# EAGLE design ASD2831 (EAGLE 6.3)
DATABASE: ./../../../../../Components/TinyCircuits_Part_Database.txt
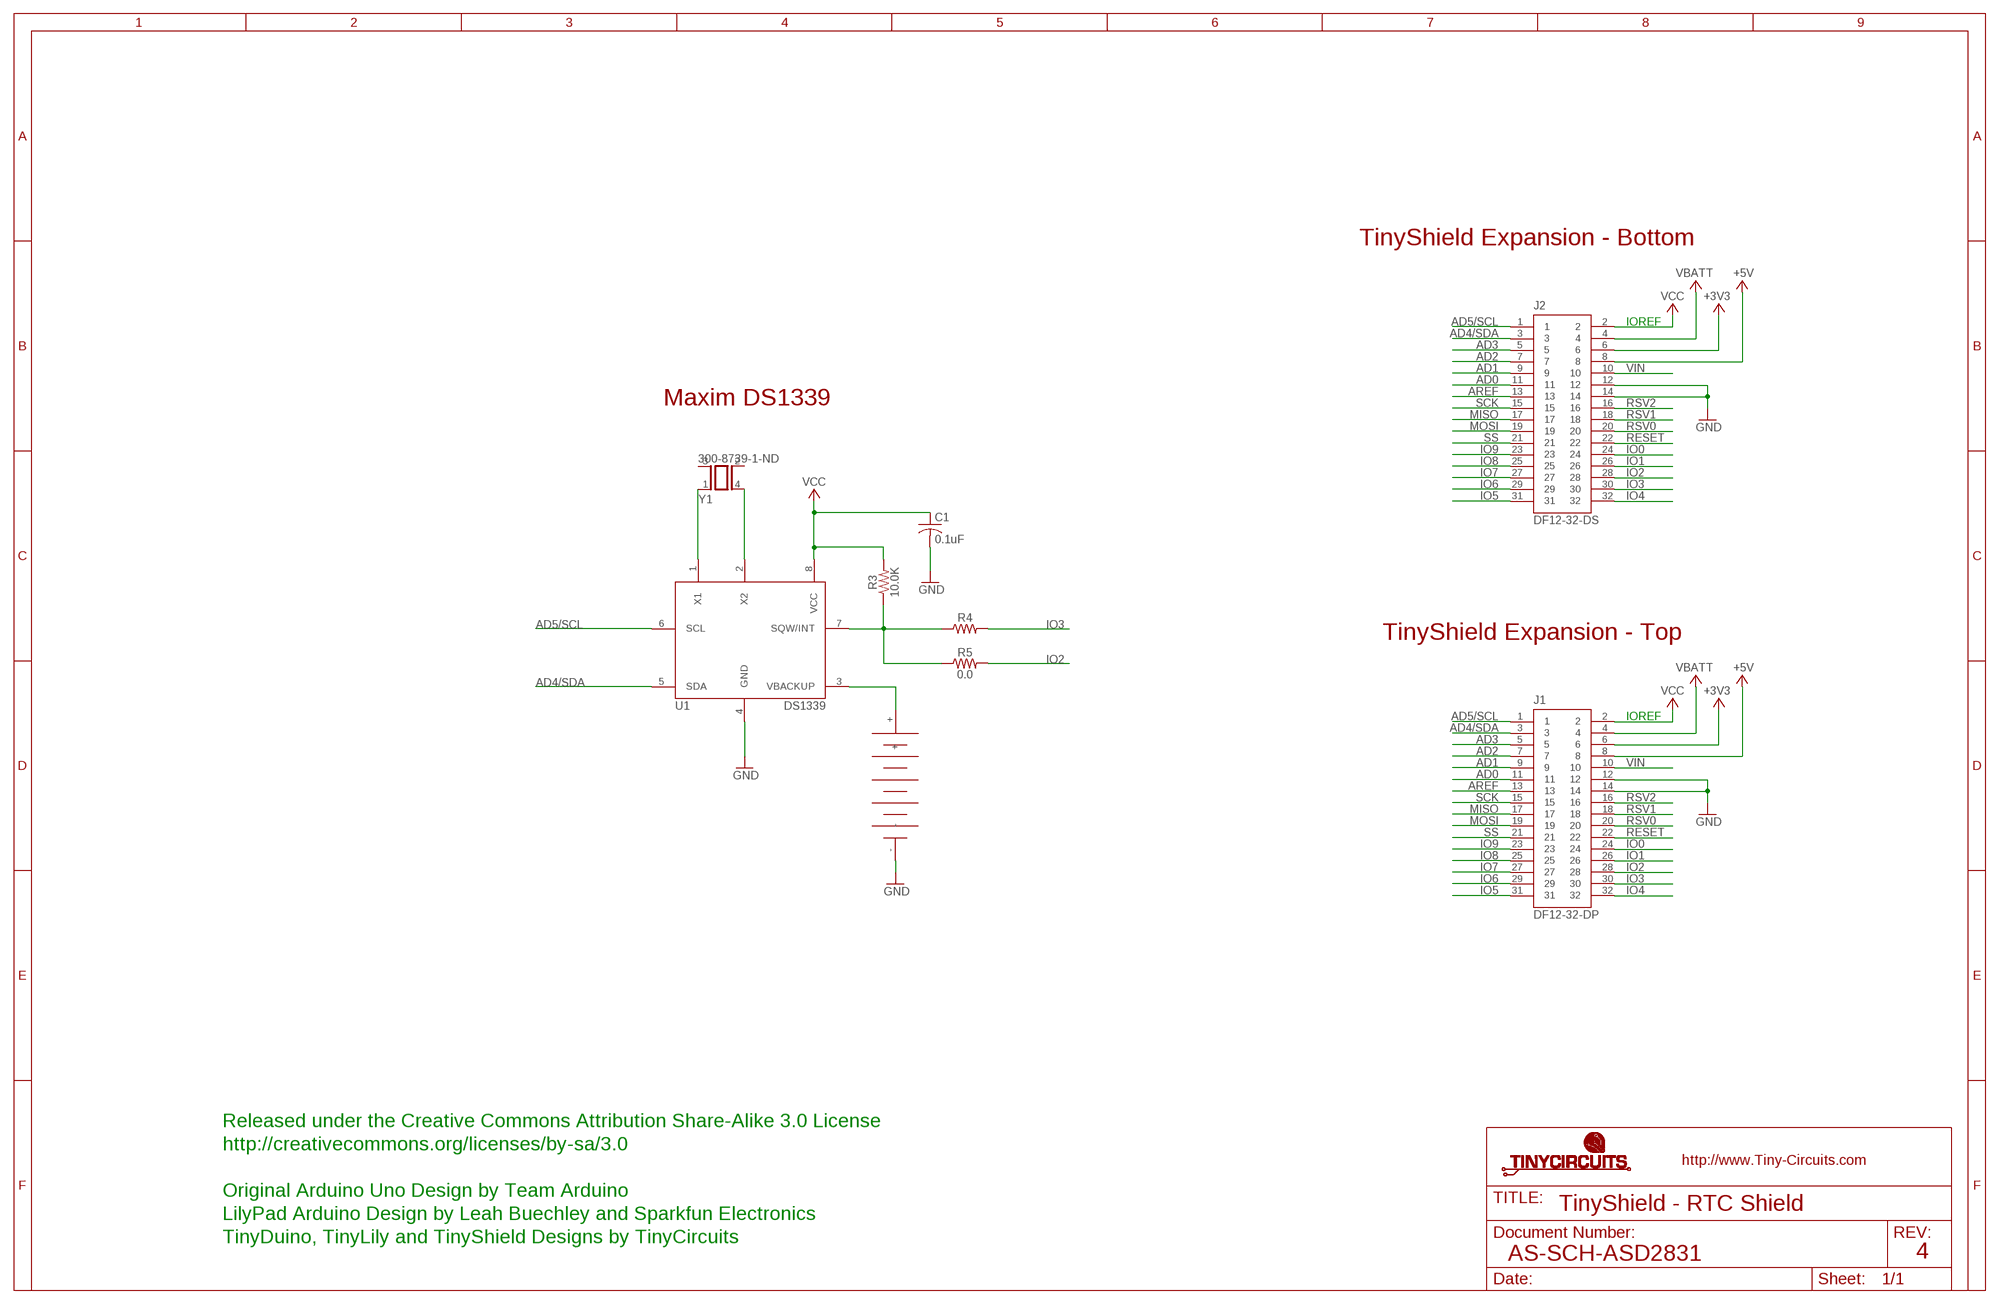
[diagram p0: schematic, sheet 1]

## Parts
B1  ML-920S/DN  AS-ITM-00182  [ML-920S/DN]
C1  0.1uF  AS-ITM-00008  [C0402]
J1  DF12-32-DP  AS-ITM-00015  [DF12-32-DP]
J2  DF12-32-DS  AS-ITM-00012  [DF12-32-DS]
R3  10.0K  AS-ITM-00032  [0402]
R4  AS-ITM-000760402_SHORT  [0402_SHORT]
R5  0.0  AS-ITM-00076  [0402]
U1  DS1339  AS-ITM-00181  [8-USOP]
Y1  300-8739-1-ND  AS-ITM-00183  [CM200C-32.768KDZBT]

## Nets
+3V3: J1.6 J2.6
+5V: J1.8 J2.8
AD0: J1.11 J2.11
AD1: J1.9 J2.9
AD2: J1.7 J2.7
AD3: J1.5 J2.5
AD4/SDA: J1.3 J2.3 U1.5(SDA)
AD5/SCL: J1.1 J2.1 U1.6(SCL)
AREF: J1.13 J2.13
GND: B1.- C1.2 J1.12 J1.14 J2.12 J2.14 U1.4(GND)
IO0: J1.24 J2.24
IO1: J1.26 J2.26
IO2: J1.28 J2.28 R5.2
IO3: J1.30 J2.30 R4.2
IO4: J1.32 J2.32
IO5: J1.31 J2.31
IO6: J1.29 J2.29
IO7: J1.27 J2.27
IO8: J1.25 J2.25
IO9: J1.23 J2.23
MISO: J1.17 J2.17
MOSI: J1.19 J2.19
N$2: U1.1(X1) Y1.1
N$4: U1.2(X2) Y1.4
N$7: R3.1 R4.1 R5.1 U1.7(SQW/INT)
N$10: B1.+ U1.3(VBACKUP)
RESET: J1.22 J2.22
RSV0: J1.20 J2.20
RSV1: J1.18 J2.18
RSV2: J1.16 J2.16
SCK: J1.15 J2.15
SS: J1.21 J2.21
VBATT: J1.4 J2.4
VCC: C1.1 J1.2 J2.2 R3.2 U1.8(VCC)
VIN: J1.10 J2.10
Unconnected: Y1.2 Y1.3

## Notes on the sheet
- TinyShield Expansion - Bottom
- IOREF
- Maxim DS1339
- TinyShield Expansion - Top
- IOREF
- Released under the Creative Commons Attribution Share-Alike 3.0 License
- http://creativecommons.org/licenses/by-sa/3.0
- Original Arduino Uno Design by Team Arduino
- TinyShield - RTC Shield
- LilyPad Arduino Design by Leah Buechley and Sparkfun Electronics
- TinyDuino, TinyLily and TinyShield Designs by TinyCircuits
- AS-SCH-ASD2831 | 4

## Library data of the parts
B1 = tinycircuits:AS-ITM-00182: BATTERY LITH 3V RECHARGE SMD; PARTNO: AS-ITM-00182
C1 = tinycircuits:AS-ITM-00008: CAP CER 0.1UF 16V 10% X5R 0402; PARTNO: AS-ITM-00008
J1 = tinycircuits:AS-ITM-00015: CONN HEADER 32POS 3MM SMD 0.5MM; PARTNO: AS-ITM-00015
J2 = tinycircuits:AS-ITM-00012: CONN RECEPT 32POS 3MM SMD 0.5MM; PARTNO: AS-ITM-00012
R3 = tinycircuits:AS-ITM-00032: RES 10.0K OHM 1/16W 1% 0402 SMD; PARTNO: AS-ITM-00032
R4 = tinycircuits:AS-ITM-00076: RES 0.0 OHM 1/16W 1% 0402 SMD; VALUE: SHORT
R5 = tinycircuits:AS-ITM-00076: RES 0.0 OHM 1/16W 1% 0402 SMD; PARTNO: AS-ITM-00076
U1 = tinycircuits:AS-ITM-00181: IC RTC CLK/CALENDAR I2C 8-USOP; PARTNO: AS-ITM-00181
Y1 = tinycircuits:AS-ITM-00183: CRYSTAL 32.768KHZ 6PF SMD; PARTNO: AS-ITM-00183; VALUE: CM200C-32.768KDZBT

## Board
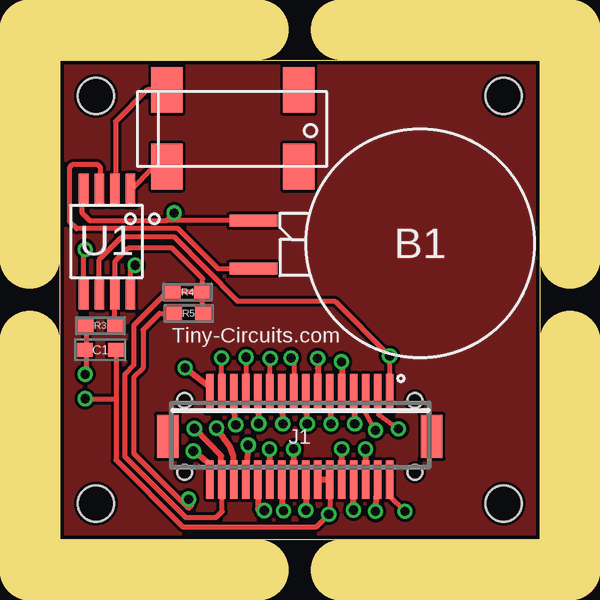
[diagram p1: board, top side]
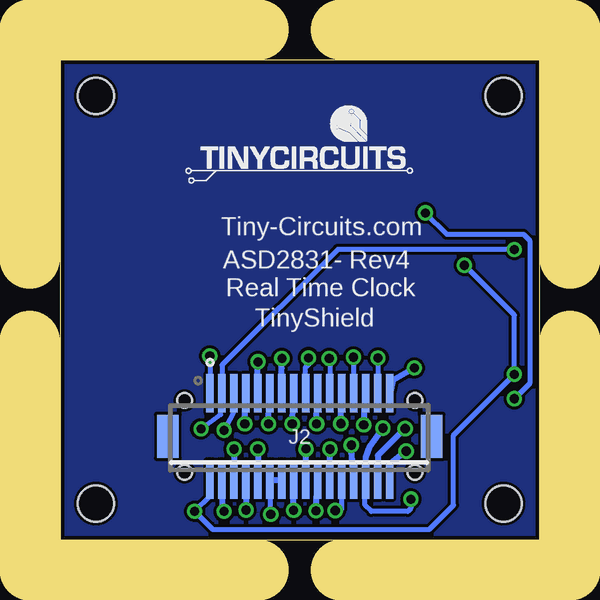
[diagram p2: board, bottom side, seen from below]

Size 20 x 20 mm. Coordinates in mm from the lower left corner, seen from the top.
Outline: 0,20 20,20 20,0 0,0 0,20
Copper layers (1*16): Top 0.035mm / dielectric 1.5mm / Bottom 0.035mm
Design rules "default *": minimum track width 5mil, minimum drill 15mil, track to track 5mil, track to pad 5mil, pad to pad 5mil, via to via 6mil, smd to smd 5mil, copper to edge 6mil, drill to drill 8mil, minimum pad ring 10mil, minimum via ring 5mil, stop-mask expansion 4mil, vias tented up to drill 25mil, thermal gap 10mil
Holes 1.5 mm at 1.5,18.5 18.5,18.5 18.5,1.5 1.5,1.5
tRestrict: 4 lines
Milling: 8 lines

### Footprints (pad centres in the part's own frame; a part is rotated, then mirrored left to right if it is on the bottom)
ML-920S/DN = smd 2 x 0.5: + 6.95,1.05; - 6.95,-0.95
C0402 = smd 0.65 x 0.6: 1 -0.65,0; 2 0.65,0
DF12-32-DP = smd 0.3 x 1.6: 1 -3.75,-1.8; 2 -3.75,1.8; 3 -3.25,-1.8; 4 -3.25,1.8; 5 -2.75,-1.8; 6 -2.75,1.8; 7 -2.25,-1.8; 8 -2.25,1.8; 9 -1.75,-1.8; 10 -1.75,1.8; 11 -1.25,-1.8; 12 -1.25,1.8; 13 -0.75,-1.8; 14 -0.75,1.8; 15 -0.25,-1.8; 16 -0.25,1.8; 17 0.25,-1.8; 18 0.25,1.8; 19 0.75,-1.8; 20 0.75,1.8; 21 1.25,-1.8; 22 1.25,1.8; 23 1.75,-1.8; 24 1.75,1.8; 25 2.25,-1.8; 26 2.25,1.8; 27 2.75,-1.8; 28 2.75,1.8; 29 3.25,-1.8; 30 3.25,1.8; 31 3.75,-1.8; 32 3.75,1.8 | smd 0.9 x 1.8: F1 -5.5,0; F2 5.5,0 | hole 0.6: -4.8,1.5; 4.8,1.5
DF12-32-DS = smd 0.3 x 1.6: 1 -3.75,1.8; 2 -3.75,-1.8; 3 -3.25,1.8; 4 -3.25,-1.8; 5 -2.75,1.8; 6 -2.75,-1.8; 7 -2.25,1.8; 8 -2.25,-1.8; 9 -1.75,1.8; 10 -1.75,-1.8; 11 -1.25,1.8; 12 -1.25,-1.8; 13 -0.75,1.8; 14 -0.75,-1.8; 15 -0.25,1.8; 16 -0.25,-1.8; 17 0.25,1.8; 18 0.25,-1.8; 19 0.75,1.8; 20 0.75,-1.8; 21 1.25,1.8; 22 1.25,-1.8; 23 1.75,1.8; 24 1.75,-1.8; 25 2.25,1.8; 26 2.25,-1.8; 27 2.75,1.8; 28 2.75,-1.8; 29 3.25,1.8; 30 3.25,-1.8; 31 3.75,1.8; 32 3.75,-1.8 | smd 0.9 x 1.8: F1 -5.5,0; F2 5.5,0 | hole 0.6: -4.8,1.5; 4.8,1.5
0402 = smd 0.65 x 0.55: 1 -0.6,0; 2 0.6,0
0402_SHORT = smd 0.65 x 0.55: 1 -0.6,0; 2 0.6,0
8-USOP = smd 0.4 x 1.35: 1 -1,-2.1; 2 -0.35,-2.1; 3 0.3,-2.1; 4 0.95,-2.1; 5 0.95,2.2; 6 0.3,2.2; 7 -0.35,2.2; 8 -1,2.2
CM200C-32.768KDZBT = smd 1.3 x 1.9: 1 -2.69,-1.5; 2 2.81,-1.5; 3 2.81,1.7; 4 -2.69,1.7

### Placement (x,y rotation side)
B1  15.02,12.35 180 top
C1  1.68,7.91 0 top
J1  10,4.3 180 top
J2  10,4.3 0 bottom
R3  1.68,8.92 180 top
R4  5.32,10.32 180 top
R5  5.37,9.43 180 top
U1  1.94,12.48 180 top
U$1  [DOCFIELD-TINYCIRCUITS-PCB]  33.91,-10 0 top  (outside the outline)
Y1  7.14,17.05 0 top

### Tracks (layer width: path | path; a pad name or v marks a point on that pad's centre or on a via)
+3V3  (via drill 0.38)
  Top 0.254: J2.6 v12.75,3.77 v12.74,3.77
  Bottom 0.254: v12.74,3.77 12.74,2.51 J2.6
+5V  (via drill 0.38)
  Top 0.254: v12.24,1.23 J2.8
  Bottom 0.254: J2.8 12.25,1.21 v12.24,1.23
AD0  (via drill 0.38)
  Top 0.254: v11.3,4.83 11.31,5.05 J2.11
  Bottom 0.254: J2.11 11.28,5.79 v11.3,4.83
AD1  (via drill 0.38)
  Top 0.254: J2.9 11.79,6.27 v11.74,7.41
  Bottom 0.254: v11.74,7.41 11.78,6.22 J2.9
AD2  (via drill 0.38)
  Top 0.254: v12.29,4.83 12.31,5.05 J2.7
  Bottom 0.254: J2.7 12.27,5.86 v12.29,4.83
AD3  (via drill 0.38)
  Top 0.203: v13.16,4.56 12.77,5.25 J2.5
  Bottom 0.203: J2.5 12.79,5.23 v13.16,4.56
AD4/SDA  (via drill 0.38)
  Top 0.203: J2.3 13.3,5.2 v14.12,4.62 | 0.99,11.27 U1.5 0.99,12.04 v1.05,12.1
  Bottom 0.203: v14.12,4.62 13.29,5.21 J2.3 13.24,7.27 8.41,12.1 v1.05,12.1
AD5/SCL  (via drill 0.38)
  Top 0.203: J2.1 v13.75,7.65 11.46,9.94 7.4,9.94 4.78,12.61 2.57,12.61 1.64,11.67 U1.6
  Bottom 0.203: v13.75,7.65 J2.1
AREF  (via drill 0.38)
  Top 0.254: J2.13 10.75,7.15 v10.75,7.55
  Bottom 0.254: v10.75,7.55 10.76,7.14 J2.13
GND  (via drill 0.38)
  Top 0.203: B1.- 4.44,13.3 | U1.4 0.92,14.51 0.92,13.62 1.24,13.3 4.44,13.3 | J2.12 11.25,1.09 v11.21,1.05 10.7,0.54 5.11,0.54 2.33,3.32 2.33,5.88 | C1.2 2.33,5.88 | 4.44,13.3 v4.76,13.62 | v1.05,5.88 2.33,5.88
  Top 0.254: J2.12 J2.14
  Bottom 0.203: v11.21,1.05 11.21,2.46 J2.12 | v4.76,13.62 3.87,12.73 0.67,12.73 0.41,12.48 0.41,6.51 v1.05,5.88
  Bottom 0.254: J2.12 J2.14
IO0  (via drill 0.38)
  Top 0.254: J2.24 8.25,1.26 v8.52,1.21
  Bottom 0.203: v8.52,1.21 8.48,1.27 8.25,1.27 J2.24
  Bottom 0.254: J2.24
IO1  (via drill 0.38)
  Top 0.254: v7.85,3.94 J2.26
  Bottom 0.254: 7.85,3.66 J2.26 v7.85,3.94
IO2  (via drill 0.38)
  Top 0.203: v5.37,1.68 5.49,1.56 5.49,1.43 5.37,1.3 3.08,3.59 3.08,6.76 3.46,7.14 3.46,8.75 4.15,9.43 R5.2
  Top 0.254: v6.53,4.64 7.07,3.89 7.22,3.49 7.29,2.61 7.26,2.51 J2.28
  Bottom 0.203: v5.37,1.68 5.37,1.3 5.49,1.18 7.02,1.18 7.27,1.43 7.27,2.48 J2.28
  Bottom 0.254: J2.28 7.24,3.43 7.07,3.88 v6.53,4.64
IO3  (via drill 0.38)
  Top 0.203: J2.30 6.76,2.49 6.76,1.18 6.51,0.92 5.24,0.92 2.7,3.46 2.7,6.89 3.08,7.27 3.08,8.92 4.48,10.32 R4.2
  Top 0.254: J2.30 6.73,3.49 v5.61,4.63
  Bottom 0.254: v5.61,4.63 6.75,3.51 6.77,2.53 J2.30
IO4  (via drill 0.38)
  Top 0.254: J2.32 6.25,3.14 v5.56,3.69
  Bottom 0.254: v5.56,3.69 5.61,3.65 6.21,3.18 6.21,3.14 6.26,3.1 J2.32
IO5  (via drill 0.38)
  Top 0.254: v5.22,7.16 6.23,6.38 J2.31
  Bottom 0.254: J2.31 6.11,6.64 v5.22,7.16
IO6  (via drill 0.38)
  Top 0.203: J2.29 6.75,7.5 6.74,7.5 6.73,7.52 v6.74,7.58
  Top 0.254: J2.29
  Bottom 0.203: v6.74,7.58 6.74,6.11 J2.29
IO7  (via drill 0.38)
  Top 0.254: v7.33,4.78 7.31,4.9 J2.27
  Bottom 0.254: J2.27 7.29,5.76 v7.33,4.78
IO8  (via drill 0.38)
  Top 0.203: v7.76,7.61 7.76,6.11 J2.25
  Bottom 0.203: J2.25 7.75,7.72 v7.76,7.61
IO9  (via drill 0.38)
  Top 0.254: v8.29,4.83 8.31,4.98 J2.23
  Bottom 0.254: J2.23 8.28,5.59 v8.29,4.83
MISO  (via drill 0.38)
  Top 0.203: v9.63,7.58 9.75,7.46 J2.17
  Bottom 0.203: J2.17 9.76,6.11 9.76,7.17 9.63,7.3 v9.63,7.58
MOSI  (via drill 0.38)
  Top 0.254: v9.3,4.83 9.31,4.95 J2.19
  Bottom 0.254: J2.19 9.27,5.76 v9.3,4.83
N$1
  pour Top: 0.06,0.13 19.92,0.09 19.93,0.09 19.97,19.96 0.06,19.96 0.08,0.13
N$2
  Top 0.203: Y1.1 3.91,15.55 U1.1
N$3
  pour Bottom: 0.06,0.12 19.92,0.09 19.97,19.98 0.08,19.98 0.09,0.14
N$4
  Top 0.203: Y1.4 3.64,18.75 2.32,17.43 2.32,14.55 | 2.32,14 2.32,14.55 | 2.32,14.55 U1.2
N$7
  Top 0.203: R3.1 U1.7 2.29,11.58 2.85,12.15 4.68,12.15 5.95,10.88 5.95,9.34 R5.1 R4.1
N$10
  Top 0.203: 7.81,11.3 B1.+ 6.59,11.3 4.94,12.96 0.69,12.96 0.41,13.24 0.41,15.53 0.54,15.65 1.56,15.65 1.68,15.53 1.68,14.62 U1.3
RESET  (via drill 0.38)
  Top 0.254: v8.74,3.77 J2.22
  Bottom 0.254: J2.22 8.75,3.69 v8.74,3.77
RSV0  (via drill 0.38)
  Top 0.254: J2.20 9.25,1.2 v9.32,1.2
  Bottom 0.254: v9.32,1.2 J2.20
RSV1  (via drill 0.38)
  Top 0.254: v9.74,3.77 9.74,2.51 J2.18
  Bottom 0.254: J2.18 9.75,3.72 v9.74,3.77
RSV2  (via drill 0.38)
  Top 0.254: J2.16 10.25,1.16 v10.25,1.22
  Bottom 0.254: v10.25,1.22 J2.16
SCK  (via drill 0.38)
  Top 0.254: v10.31,4.83 10.31,4.98 J2.15
  Bottom 0.254: J2.15 10.29,5.66 v10.31,4.83
SS  (via drill 0.38)
  Top 0.203: J2.21 8.77,6.12 v8.77,7.55
  Bottom 0.203: v8.77,7.55 8.75,7.53 J2.21
VBATT  (via drill 0.38)
  Top 0.254: v13.16,1.17 J2.4
  Bottom 0.254: J2.4 13.23,1.21 v13.16,1.17
VCC  (via drill 0.38)
  Top 0.203: v14.38,1.18 13.75,1.81 J2.2 | C1.1 1.08,7.96 R3.2 1.08,6.93 v1.05,6.89 | U1.8 2.94,11.24 v3.13,11.44
  Bottom 0.203: J2.2 13.75,1.81 v14.38,1.18 13.62,0.41 4.61,0.41 3.59,1.43 3.59,4.35 v1.05,6.89 1.05,9.36 v3.13,11.44
VIN  (via drill 0.38)
  Top 0.254: J2.10 v11.76,3.78 v11.75,3.78
  Bottom 0.254: v11.75,3.78 J2.10

### Text on the board
tPlace: Tiny-Circuits.com
bPlace: Tiny-Circuits.com | ASD2831- Rev4 | Real Time Clock | TinyShield
Document: FABRICATION DRAWING | NOTES: | 1. PRINTED CIRCUIT BOARD MADE FROM NEMA GRADE FR-4 EPOXY LAMINATE | WITH 1 OUNCE COPPER PLATING AND .024 THICKNESS. | 2. ALL DIMENSIONS ARE GIVEN IN INCHES. | 3. CIRCUIT PATHS ARE FOR REFERENCE ONLY. | 4. HOLE SIZES SHOWN ARE FINISHED DIAMETERS AFTER PLATING. | 5. BOARD PLATED USING REFLOW OR SIMILAR METHOD. | 6. BOARD TO HAVE BLUE SOLDER MASK ON PLATED SURFACES USING WET FILM | 7. SILKSCREEN BOARD USING WHITE INK. | SR100 OR SR1010 EPOXY. EQUIVALENT WET OR DRY FILM MAY BE USED. | 8. THE FOLLOWING INFORMATION APPLIES TO THIS BOARD: | * 2 COPPER LAYERS | * .024 BOARD THICKNESS | * REQUIRES TOP SIDE SILKSCREEN | Released under the Creative Commons Attribution Share-Alike 3.0 License | http://creativecommons.org/licenses/by-sa/3.0 | Original Arduino Uno Design by Team Arduino | LilyPad Arduino Design by Leah Buechley and Sparkfun Electronics | TinyDuino, TinyLily and TinyShield Designs by TinyCircuits | TinyShield - RTC Shield | AS-PCB-ASD2831 | 4